# Altium project pca10156.PrjPCB (part 3 of 4)

## Sheet pca10156_sheet6_power_supply.SchDoc: =BoardTitle+' - Power Supply'
size A3; Organization: Nordic Semiconductor; DocumentNumber: 6; Revision: 1.0.0; SheetNumber: 6; SheetTotal: 8; Author: STL1; CompanyName: Nordic Semiconductor; DrawnBy: STL1; DocumentSize: A4
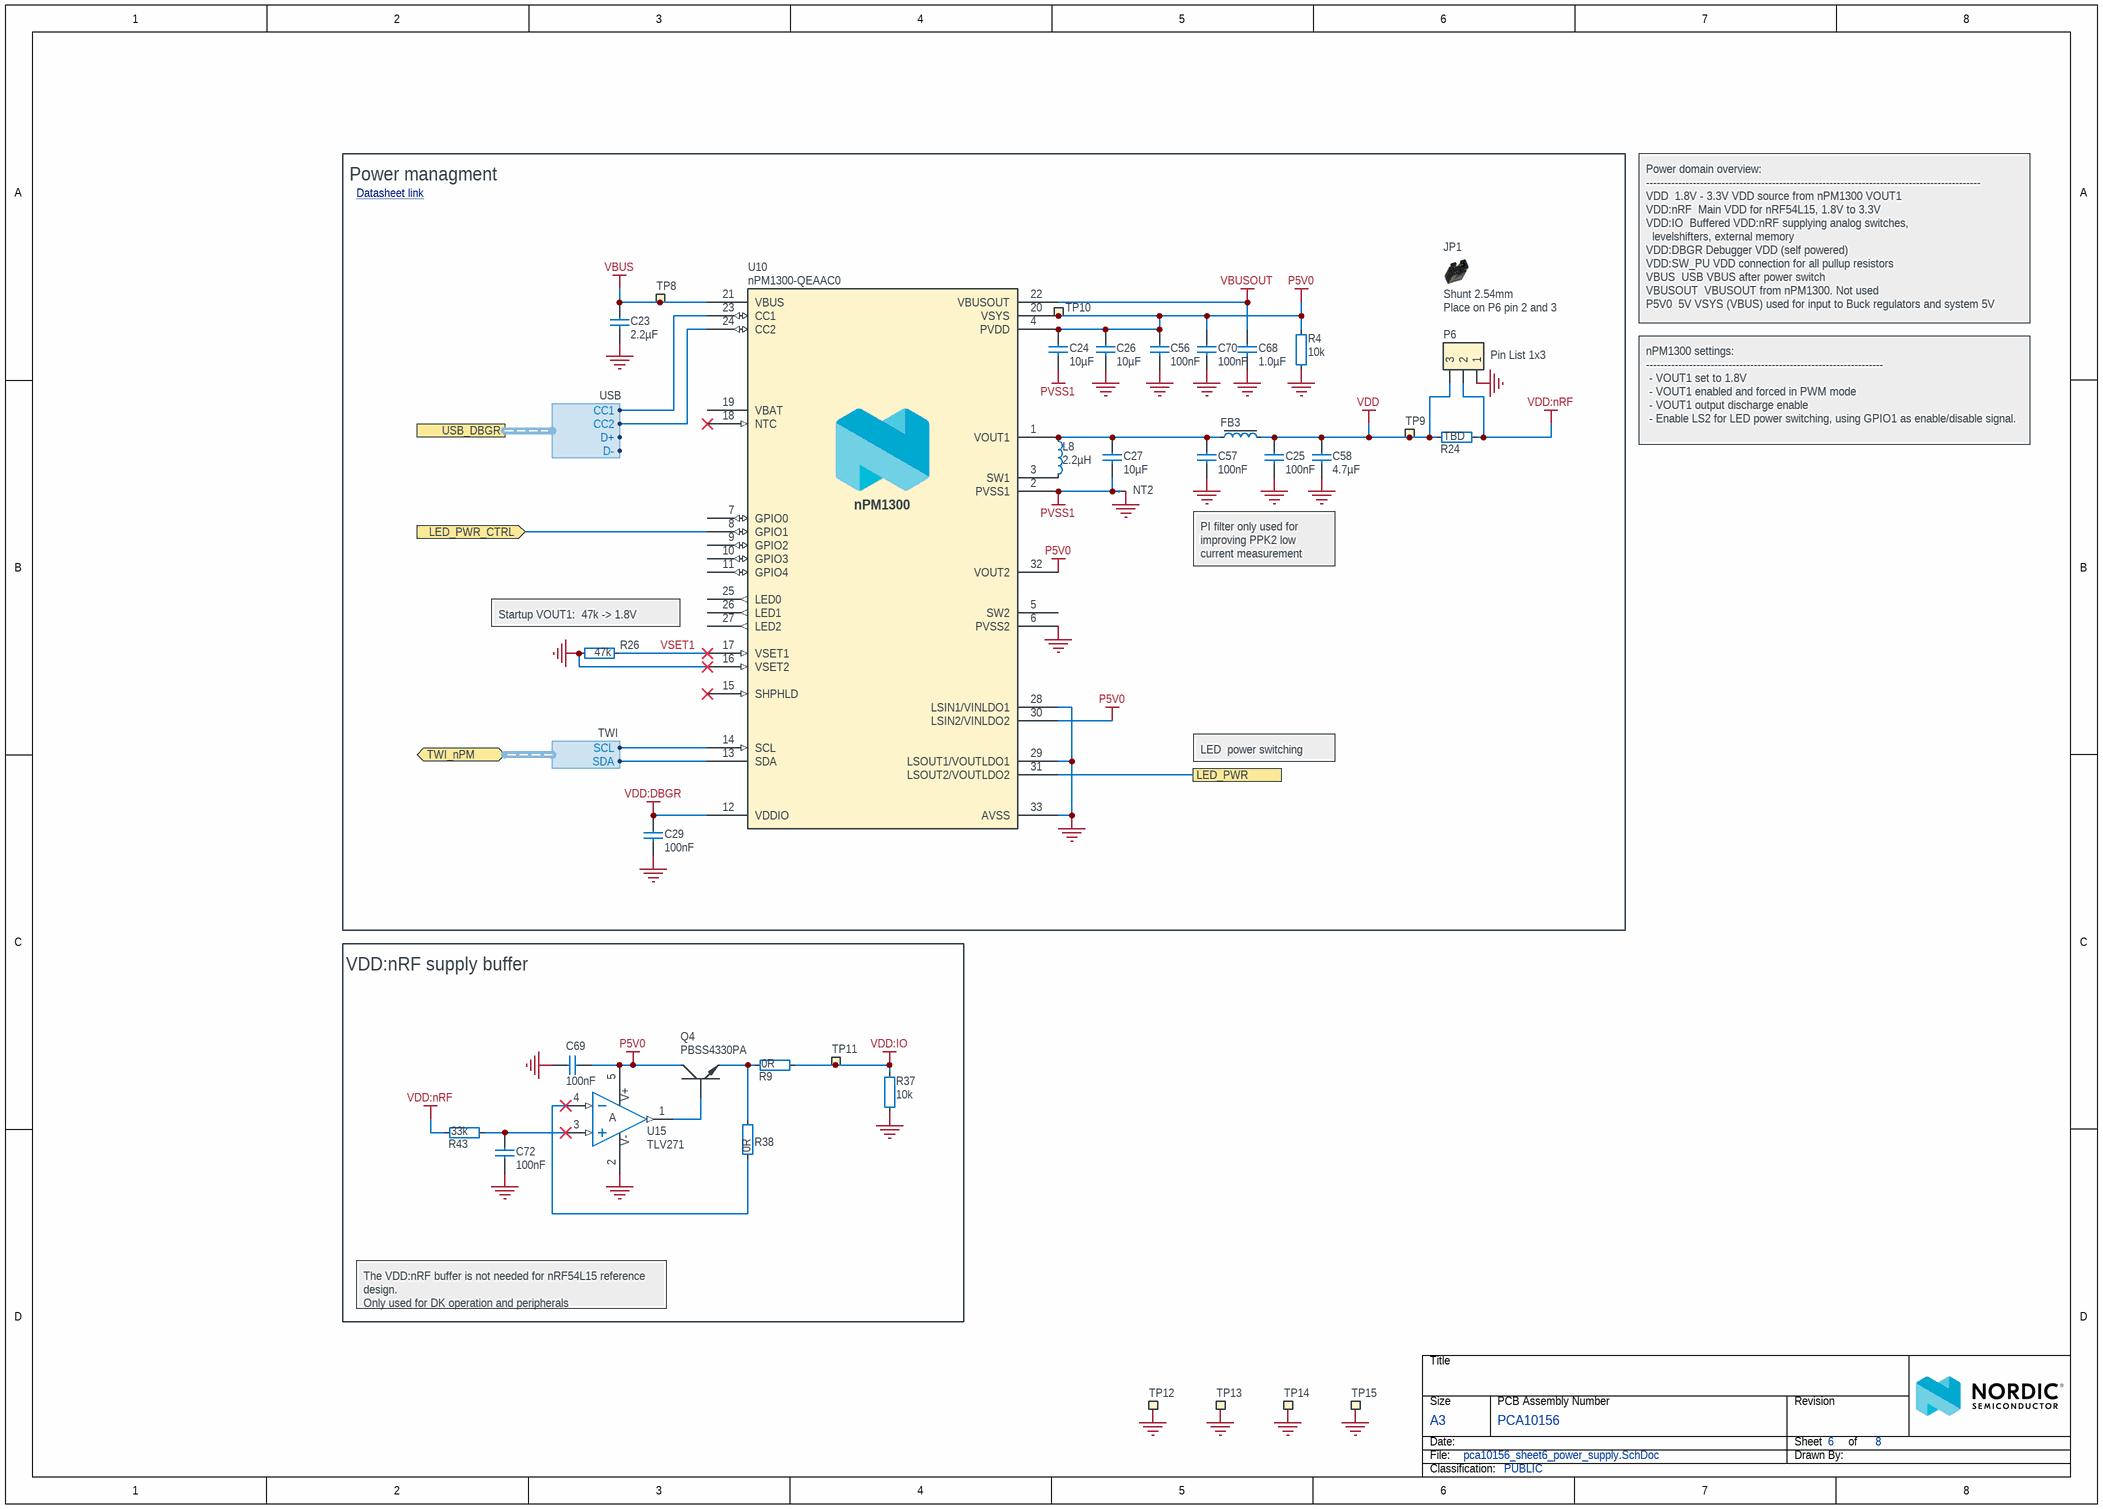
[diagram p5: pca10156_sheet6_power_supply.SchDoc]

### Parts
C23  2.2µF  [CAPC1005X04L]
C24  10µF  [CAPC1608X06L]
C25  100nF  [CAPC0603X03L_C]
C26  10µF  [CAPC1608X06L]
C27  10µF  [CAPC1608X06L]
C29  100nF  [CAPC0603X03L_C]
C56  100nF  [CAPC0603X03L_C]
C57  100nF  [CAPC0603X03L_C]
C58  4.7µF  [CAPC1608X06L]
C68  1.0µF  [CAPC1005X04L]
C69  100nF  [CAPC0603X03L_C]
C70  100nF  [CAPC0603X03L_C]
C72  100nF  [CAPC0603X03L_C]
FB3  120R/0.55A  [INDC1005X04L]  (value not drawn)
JP1  Shunt 2.54mm  Assembly: Place on P6 pin 2 and 3  [Shunt_2.54mm_Vertical]
L8  2.2µH  [INDC2016X10N]
NT2  Net tie  [2 PIN STARPOINT]  (value not drawn)  (net tie, no BOM)
P6  Pin List 1x3  [LIST_1x3_SMD]
Q4  PBSS4330PA  [DFN105P200X65-3N_v2]
R4  10k  [RESC0603X03L_C]
R9  0R  [RESC0603X03L_C]
R24  TBD  [RESC1005X04L]
R26  47k  [RESC0603X03L_C]
R37  10k  [RESC0603X03L_C]
R38  0R  [RESC0603X03L_C]
R43  33k  [RESC0603X03L_C]
TP8  Ø1.5mm,SMD  [TP_SMD_D1.5mm]  (value not drawn)  (no BOM)
TP9  Ø1.5mm,SMD  [TP_SMD_D1.5mm]  (value not drawn)  (no BOM)
TP10  Ø1.5mm,SMD  [TP_SMD_D1.5mm]  (value not drawn)  (no BOM)
TP11  Ø1.5mm,SMD  [TP_SMD_D1.5mm]  (value not drawn)  (no BOM)
TP12  Ø1.5mm,SMD  [TP_SMD_D1.5mm]  (value not drawn)  (no BOM)
TP13  Ø1.5mm,SMD  [TP_SMD_D1.5mm]  (value not drawn)  (no BOM)
TP14  Ø1.5mm,SMD  [TP_SMD_D1.5mm]  (value not drawn)  (no BOM)
TP15  Ø1.5mm,SMD  [TP_SMD_D1.5mm]  (value not drawn)  (no BOM)
U10  nPM1300-QEAAC0  [Nordic_QFN50P500X500X90-33N]
U15  TLV271  [SOT95P280X145-5N]

### Blocks framed on the sheet
Power managment: C23-C27 C29 C56-C58 C68 C70 FB3 JP1 L8 NT2 P6 R4 R24 R26 TP8-TP10 U10
VDD:nRF supply buffer: C69 C72 Q4 R9 R37 R38 R43 TP11 U15

### Ports
LED_PWR, LED_PWR_CTRL (in), TWI_nPM (bidir, harness TWI), USB_DBGR (harness USB)

### Harnesses
TWI: SDA, SCL
USB: D+, D-, CC1, CC2

### Nets
GND: C23.1 C25.1 C26.1 C29.2 C56.1 C57.1 C58.2 C68.1 C69.2 C70.1 C72.2 NT2.1 P6.1 R4.1 R26.2 R37.1 TP12.1 TP13.1 TP14.1 TP15.1 U10.6(PVSS2) U10.16(VSET2) U10.28(LSIN1/VINLDO1) U10.29(LSOUT1/VOUTLDO1) U10.33(AVSS) U15.2(VSS)
P5V0: C24.2 C26.2 C56.2 C69.1 C70.2 Q4.3(C) R4.2 TP10.1 U10.4(PVDD) U10.20(VSYS) U10.30(LSIN2/VINLDO2) U10.32(VOUT2) U15.5(VDD)
PVSS1: C24.1 C27.1 NT2.2 U10.2(PVSS1)
VBUS: C23.2 TP8.1 U10.21(VBUS)
VBUSOUT: C68.2 U10.22(VBUSOUT)
VDD: C25.2 C58.1 FB3.2 P6.3 R24.2 TP9.1
VDD:DBGR: C29.1 U10.12(VDDIO)
VDD:IO: R9.2 R37.2 TP11.1
VDD:nRF: P6.2 R24.1 R43.1
LED_PWR_CTRL: U10.8(GPIO1) ; port LED_PWR_CTRL
TWI0_SCL: U10.14(SCL) ; port TWI_nPM.SCL
TWI0_SDA: U10.13(SDA) ; port TWI_nPM.SDA
VSET1: R26.1 U10.17(VSET1)
NetC27_2: C27.2 C57.2 FB3.1 L8.1 U10.1(VOUT1)
NetC64_2: U10.31(LSOUT2/VOUTLDO2) ; port LED_PWR
NetC72_1: C72.1 R43.2 U15.3(IN+)
NetJ3_A5: U10.23(CC1) ; port USB_DBGR.CC1
NetJ3_B5: U10.24(CC2) ; port USB_DBGR.CC2
NetL8_2: L8.2 U10.3(SW1)
NetQ4_1: Q4.1(B) U15.1(OUT)
NetQ4_2: Q4.2(E) R9.1 R38.2
NetR38_1: R38.1 U15.4(IN-)

Not connected (* = marked no-connect by the designer): U10 5(SW2) 7(GPIO0) 9(GPIO2) 10(GPIO3) 11(GPIO4) 15(SHPHLD)* 18(NTC)* 19(VBAT) 25(LED0) 26(LED1) 27(LED2)

### Notes on the sheet
- Datasheet link <https://www.nordicsemi.com/Products/nPM1300>
- Power domain overview:
  ---------------------------------------------------------------------------------------------
  VDD		1.8V - 3.3V VDD source from nPM1300 VOUT1
  VDD:nRF		Main VDD for nRF54L15, 1.8V to 3.3V
  VDD:IO		Buffered VDD:nRF supplying analog switches,
  levelshifters, external memory
  VDD:DBGR	Debugger VDD (self powered)
  VDD:SW_PU	VDD connection for all pullup resistors
  VBUS		USB VBUS after power switch
  VBUSOUT		VBUSOUT from nPM1300. Not used
  P5V0		5V VSYS (VBUS) used for input to Buck regulators and system 5V
- nPM1300 settings:
  ------------------------------------------------------------------
  - VOUT1 set to 1.8V
  - VOUT1 enabled and forced in PWM mode
  - VOUT1 output discharge enable
  - Enable LS2 for LED power switching, using GPIO1 as enable/disable signal.
- PI filter only used for improving PPK2 low current measurement accuracy
- (near R26) Startup VOUT1:  47k -> 1.8V
- LED  power switching
- The VDD:nRF buffer is not needed for nRF54L15 reference design.
  Only used for DK operation and peripherals
- Title
- Size
- Date:
- File:
- A3
- PCB Assembly Number
- Sheet
- Drawn By:
- Revision
- of
- Classification:
- (in symbol nPM1300-QEAAC0) nPM1300
- (in symbol TLV271CW5-7) V+; A; V-

### Library data of the parts
C23 = C0402-2µ2-10V: Capacitor, X5R, ±10%; Manufacturer: N.A.; Part number NEMS: 100200376; Component Status: Active; Pad Count: 2; Note: 10V; Part Number: C0402-2µ2-10V; PartId: 100200376; Component Class: Capacitors; Author: rsk; Manufacturer Part Number: N.A.; ComponentLink1URL: N.A.; ComponentLink1Description: Datasheet; ComponentLink2URL: N.A.; ComponentLink2Description: Supplier link; HelpURL: N.A.; LatestRevisionDate: 2020-10-13; Published: 2016-08-22; Footprint Doc: 0402; Value: 2.2µF; Supplier 1: Digi-Key; Supplier Part Number 1: 490-10451-1-ND; Supplier 2: N.A.; Supplier Part Number 2: N.A.; Artikkelnr Noca: N.A.; Part number IPS: N.A.; Part number Norautron: N.A.
C24 C26 C27 = C0603-10µ-10V-X7T-GRM188D71A106MA73: Capacitor, X7T, ±20%, 10V; Manufacturer: Murata; Part number IPS: 00000004696; Part number NEMS: 100200414; Component Status: Active; Pad Count: 2; Note: 10VDC; Artikkelnr Noca: N.A.; Part Number: C0603-10µ-10V-X7T-GRM188D71A106MA73; PartId: 100200414; Component Class: Capacitors; Author: rsk; Manufacturer Part Number: GRM188D71A106MA73; ComponentLink1URL: N.A.; ComponentLink1Description: Datasheet; ComponentLink2URL: N.A.; ComponentLink2Description: Supplier link; HelpURL: https://no.mouser.com/datasheet/2/281/murata_03052018_GRM_Series_1-1310166.pdf; LatestRevisionDate: 2021-07-22; Published: 2018-09-11; Footprint Doc: 0603; Value: 10µF; Supplier 1: Digi-Key; Supplier Part Number 1: 490-7200-1-ND; Supplier 2: Mouser; Supplier Part Number 2: 81-GRM188D71A106MA3D; Part number Norautron: N.A.
C25 C56 C57 C70 = C0201-100n: as C64 on sheet pca10156_sheet5_misc; Part Number: C0201-100n; Manufacturer Part Number: N.A.; LatestRevisionDate: 2017-11-09; Published: 2014-11-13; Value: 100nF; Artikkelnr Noca: N.A.; Footprint Doc: 0201; ComponentLink1URL: N.A.; ComponentLink1Description: Datasheet; ComponentLink2URL: N.A.; ComponentLink2Description: Supplier link; HelpURL: N.A.; Supplier 1: N.A.; Supplier Part Number 1: N.A.; Supplier 2: N.A.; Supplier Part Number 2: N.A.; Component Class: Capacitors; PartId: 100200078; Author: rsk
C29 C69 C72 = C0201-100n: as C4 on sheet pca10156_sheet2_nRF54L15; Part Number: C0201-100n; Value: 100nF; Footprint Doc: 0201; Component Class: Capacitors; Author: rsk; PartId: 100200078; Manufacturer Part Number: N.A.; ComponentLink1URL: N.A.; ComponentLink1Description: Datasheet; ComponentLink2URL: N.A.; ComponentLink2Description: Supplier link; HelpURL: N.A.; LatestRevisionDate: 2017-11-09; Published: 2014-11-13; Supplier 1: N.A.; Supplier Part Number 1: N.A.; Supplier 2: N.A.; Supplier Part Number 2: N.A.; Artikkelnr Noca: N.A.
C58 = C0603-4µ7-10V-X7S: as C42 on sheet pca10156_sheet3_debugger; Part Number: C0603-4µ7-10V-X7S; Value: 4.7µF; Footprint Doc: 0603; Component Class: Capacitors; Author: rsk; PartId: 100200351; Manufacturer Part Number: N.A.; ComponentLink1URL: N.A.; ComponentLink1Description: Datasheet; ComponentLink2URL: N.A.; ComponentLink2Description: Supplier link; HelpURL: N.A.; LatestRevisionDate: 2016-08-15; Published: 2016-08-15; Note: 10V; Supplier 1: Digi-Key; Supplier Part Number 1: 445-14258-1-ND; Supplier 2: N.A.; Supplier Part Number 2: N.A.; Part number Norautron: N.A.
C68 = C0402-1µ0-6.3V-X5R-10%: as C31 on sheet pca10156_sheet3_debugger; Part Number: C0402-1µ0-6.3V-X5R-10%; Manufacturer Part Number: N.A.; LatestRevisionDate: 2022-01-27; Published: 2022-01-27; Value: 1.0µF; Note: 6.3V; Artikkelnr Noca: N.A.; Footprint Doc: 0402; ComponentLink1URL: N.A.; ComponentLink1Description: Datasheet; ComponentLink2URL: N.A.; ComponentLink2Description: Supplier link; HelpURL: N.A.; Supplier 1: N.A.; Supplier Part Number 1: N.A.; Supplier 2: N.A.; Supplier Part Number 2: N.A.; Part number IPS: N.A.; Component Class: Capacitors; PartId: 100200498; Author: rubr
FB3 = FB0402-120R@100M-500mA: Ferrite Bead, 120 Ohm @ 100MHz, 500mA, 250 mOhm Max; Manufacturer: Murata; Manufacturer Part Number: BLM15AG121SN1D; Part number IPS: 00000009954; Part number Norautron: 265230631; Part number NEMS: 100300099; Note: Chip EMIFIL Inductor Type Chip Ferrite Bead; Artikkelnr Noca: 33029317; Pad Count: 2; Component Status: Active; Part Number: FB0402-120R@100M-500mA; Footprint Doc: 0402; LatestRevisionDate: 2014-01-10; Published: 2011-11-14; Value: 120R/0.55A; ComponentLink1Description: Datasheet; ComponentLink2Description: Supplier link; ComponentLink1URL: N.A.; ComponentLink2URL: N.A.; HelpURL: http://search.murata.co.jp/Ceramy/image/img/PDF/ENG/L0110S0100BLM15A_SN.pdf; Supplier 1: Digi-Key; Supplier Part Number 1: 490-1005-1-ND; Supplier 2: Farnell; Supplier Part Number 2: 151-5760; Component Class: Inductors; PartId: 100300099; Author: rsk
JP1 = SHUNT JUMPER 2.54mm Black Vertical: Shunt Jumper 2.54mm Black, open top; Manufacturer: WCON; Manufacturer Part Number: 3710-6001OS0B05; Part number NEMS: 100500728; Pad Count: 2; Note: N.A.; Component Status: Active; System: Connector; Part Number: SHUNT JUMPER 2.54mm Black Vertical; PartId: 100500752; Component Class: Connectors; Author: masi; ComponentLink1URL: N.A.; ComponentLink1Description: Datasheet; ComponentLink2URL: N.A.; ComponentLink2Description: Supplier link; HelpURL: N.A.; Footprint Doc: SHUNT JUMPER 2.54mm; LatestRevisionDate: 2024-08-02; Published: 2022-07-01; Value: Shunt 2.54mm; Supplier 1: Cabcon; Supplier Part Number 1: 3710-6001OS0B05; Supplier 2: N.A.; Supplier Part Number 2: N.A.; Artikkelnr Noca: N.A.; Part number IPS: N.A.; Part number Norautron: N.A.
L8 = L0806-2µ2-2500mA-73mOhm-CIGT201610EH2R2MNE: Inductor, Irms=2.5A, Isat=2.9A, ±20%, DCR=73mΩ; Manufacturer: Samsung Electro-Mechanics America; Part number Norautron: 26521789; Part number NEMS: 100300400; Component Status: Active; Pad Count: 2; Note: Unshielded Thin Film Inductor; Artikkelnr Noca: N.A.; Part Number: L0806-2µ2-2500mA-73mOhm-CIGT201610EH2R2MNE; PartId: 100300400; Component Class: Inductors; Author: rsk; Manufacturer Part Number: CIGT201610EH2R2MNE; ComponentLink1URL: https://media.digikey.com/pdf/Data%20Sheets/Samsung%20PDFs/CIGT201610EH2R2MNE_Spec.pdf; ComponentLink1Description: Datasheet; ComponentLink2URL: https://www.digikey.com/en/products/detail/samsung-electro-mechanics/CIGT201610EH2R2MNE/7041223?s=N4IgTCBcDaIMIEkDiAVMAGAjANk%2BgogBJgBKYAsgHL4gC6AvkA; ComponentLink2Description: Supplier link; HelpURL: http://product.samsungsem.com/pi/CIGT201610EH2R2MN.do; LatestRevisionDate: 2022-09-07; Published: 2021-02-03; Footprint Doc: 0806; Value: 2.2µH; Supplier 1: Digi-Key; Supplier Part Number 1: 1276-6901-1-ND; Supplier 2: Mouser; Supplier Part Number 2: 187-CIGT201610EH2R2M; Part number IPS: N.A.
NT2 = 2 pin starpoint: Starpoint; Manufacturer: N.A.; Part number NEMS: 100500603; Pad Count: 2; Component Status: Active; System: Connector; Part Number: 2 pin starpoint; Manufacturer Part Number: N.A.; ComponentLink1URL: N.A.; ComponentLink1Description: Datasheet; ComponentLink2URL: N.A.; ComponentLink2Description: Supplier link; HelpURL: N.A.; Footprint Doc: N.A.; LatestRevisionDate: 2017-08-31; Published: 2017-08-31; Value: Net tie; Note: Net tie; Supplier 1: N.A.; Supplier Part Number 1: N.A.; Supplier 2: N.A.; Supplier Part Number 2: N.A.; Artikkelnr Noca: N.A.; Part number IPS: N.A.; Component Class: Connectors; PartId: 100500603; Author: rsk; Part number Norautron: N.A.
P6 = Pin List 1x3 SMD: Pin List 1x3, 2.54mm (100mil), SMD; Manufacturer: WCON; Manufacturer Part Number: 1125-1103S0M116CR04; Part number Norautron: 26470016; Part number NEMS: 100500306; Note: N.A.; Pad Count: 3; Component Status: Active; System: Connector; Part Number: Pin List 1x3 SMD; Footprint Doc: LIST_1x3_SMD; LatestRevisionDate: 2021-09-24; Published: 2013-10-21; Value: Pin List 1x3; Artikkelnr Noca: N.A.; ComponentLink1URL: N.A.; ComponentLink1Description: Datasheet; ComponentLink2URL: N.A.; ComponentLink2Description: Supplier link; HelpURL: N.A.; Part number IPS: N.A.; Supplier 1: Cabcon; Supplier Part Number 1: 1125-1103S0M116CR04; Supplier 2: Samtec; Supplier Part Number 2: TSM-103-01-L-SV-P-TR; Component Class: Connectors; PartId: 100500306; Author: rsk
Q4 = PBSS4330PA,115: 30V, 3A, 2.1W, G=270, NPN Transistor; Manufacturer: Nexperia; Part number NEMS: 101300184; Component Status: Active; Pad Count: 3; Note: N.A.; Part Number: PBSS4330PA,115; PartId: 101300184; Component Class: Semiconductors; Author: rubr; Manufacturer Part Number: PBSS4330PA,115; ComponentLink1URL: https://assets.nexperia.com/documents/data-sheet/PBSS4330PA.pdf; ComponentLink1Description: Datasheet; ComponentLink2URL: https://www.digikey.com/en/products/detail/nexperia-usa-inc/PBSS4330PA-115/2296330; ComponentLink2Description: Supplier link; HelpURL: https://www.nexperia.com/products/bipolar-transistors/general-purpose-and-low-vcesat-bipolar-transistors/single-bipolar-transistors/single-bipolar-transistors-100-v/PBSS4330PA.html; LatestRevisionDate: 2021-06-03; Published: 2021-06-03; Footprint Doc: HUSON-3 (2x2); Value: PBSS4330PA; Supplier 1: Digi-Key; Supplier Part Number 1: 1727-5112-1-ND‎; Supplier 2: N.A.; Supplier Part Number 2: N.A.; Artikkelnr Noca: N.A.; Part number IPS: N.A.; Part number Norautron: N.A.
R4 R37 = R0201-10k: Resistor, ±1%, 0.05W; Manufacturer: N.A.; Part number IPS: 00000001255; Part number Norautron: 26107101; Part number NEMS: 100100065; Component Status: Active; Pad Count: 2; Note: Chip Res 1%; Part Number: R0201-10k; PartId: 100100065; Component Class: Resistors; Author: rsk; Manufacturer Part Number: N.A.; ComponentLink1URL: N.A.; ComponentLink1Description: Datasheet; ComponentLink2URL: N.A.; ComponentLink2Description: Supplier link; HelpURL: N.A.; LatestRevisionDate: 2014-11-13; Published: 2014-11-13; Footprint Doc: 0201; Value: 10k; Supplier 1: N.A.; Supplier Part Number 1: N.A.; Supplier 2: N.A.; Supplier Part Number 2: N.A.; Artikkelnr Noca: N.A.
R9 R38 = R0201-0R: Resistor, ±5%, 0.05W; Manufacturer: N.A.; Part number IPS: 00000003245; Part number NEMS: 100100001; Component Status: Active; Pad Count: 2; Note: Chip Res 5%; Part Number: R0201-0R; PartId: 100100001; Component Class: Resistors; Author: rsk; Manufacturer Part Number: N.A.; ComponentLink1URL: N.A.; ComponentLink1Description: Datasheet; ComponentLink2URL: N.A.; ComponentLink2Description: Supplier link; HelpURL: N.A.; LatestRevisionDate: 2017-11-09; Published: 2014-11-13; Footprint Doc: 0201; Value: 0R; Supplier 1: N.A.; Supplier Part Number 1: N.A.; Supplier 2: N.A.; Supplier Part Number 2: N.A.; Artikkelnr Noca: N.A.; Part number Norautron: N.A.
R24 = R0402-TBD: Chip Res 0402; Manufacturer: N.A.; Part number NEMS: 100100282; Component Status: Active; Pad Count: 2; Part Number: R0402-TBD; PartId: 100100282; Component Class: Resistors; Author: rsk; Manufacturer Part Number: N.A.; ComponentLink1URL: N.A.; ComponentLink1Description: Datasheet; ComponentLink2URL: N.A.; ComponentLink2Description: Supplier link; HelpURL: N.A.; LatestRevisionDate: 2010-12-21; Published: 2010-12-21; Footprint Doc: 0402; Value: TBD; Note: Chip Res; Supplier 1: N.A.; Supplier Part Number 1: N.A.; Supplier 2: N.A.; Supplier Part Number 2: N.A.; Artikkelnr Noca: N.A.; Part number IPS: N.A.; Part number Norautron: N.A.
R26 = R0201-47k: Resistor, ±1%, 0.05W; Manufacturer: N.A.; Part number IPS: 00000001423; Part number NEMS: 100100076; Component Status: Active; Pad Count: 2; Note: Chip Res 1%; Part Number: R0201-47k; PartId: 100100076; Component Class: Resistors; Author: rsk; Manufacturer Part Number: N.A.; ComponentLink1URL: N.A.; ComponentLink1Description: Datasheet; ComponentLink2URL: N.A.; ComponentLink2Description: Supplier link; HelpURL: N.A.; LatestRevisionDate: 2014-11-13; Published: 2014-11-13; Footprint Doc: 0201; Value: 47k; Supplier 1: N.A.; Supplier Part Number 1: N.A.; Supplier 2: N.A.; Supplier Part Number 2: N.A.; Artikkelnr Noca: N.A.; Part number Norautron: N.A.
R43 = R0201-33k: Resistor, ±1%, 0.05W; Manufacturer: N.A.; Part number IPS: 00000001708; Part number NEMS: 100100073; Component Status: Active; Pad Count: 2; Note: Chip Res 1%; Part Number: R0201-33k; PartId: 100100073; Component Class: Resistors; Author: rsk; Manufacturer Part Number: N.A.; ComponentLink1URL: N.A.; ComponentLink1Description: Datasheet; ComponentLink2URL: N.A.; ComponentLink2Description: Supplier link; HelpURL: N.A.; LatestRevisionDate: 2014-11-13; Published: 2014-11-13; Footprint Doc: 0201; Value: 33k; Supplier 1: N.A.; Supplier Part Number 1: N.A.; Supplier 2: N.A.; Supplier Part Number 2: N.A.; Artikkelnr Noca: N.A.; Part number Norautron: N.A.
TP8-TP15 = TP_SMD_Ø1.5MM: as TP1 on sheet pca10156_sheet2_nRF54L15; Part Number: TP_SMD_Ø1.5MM; ComponentLink1URL: N.A.; ComponentLink1Description: Datasheet; ComponentLink2URL: N.A.; ComponentLink2Description: Supplier link; HelpURL: N.A.; Footprint Doc: TP_SMD_Ø1.5mm; LatestRevisionDate: 2021-03-05; Published: 2016-06-02; Value: Ø1.5mm,SMD; Note: N.A.; Supplier 1: N.A.; Supplier Part Number 1: N.A.; Supplier 2: N.A.; Supplier Part Number 2: N.A.; Artikkelnr Noca: N.A.; Part number IPS: N.A.; Component Class: Connectors; PartId: 100500477; Author: rsk; Part number Norautron: N.A.
U10 = nPM1300-QEAAC0: Li-Ion/Li-Polymer USB-C battery charger with high efficiency buck regulators, LDOs or load switches, LED drivers, TWI and VBUSOUT; Manufacturer: Nordic Semiconductor; Part number NEMS: 102000306; Component Status: Active; Pad Count: 33; Note: Production version; Artikkelnr Noca: N.A.; Part Number: nPM1300-QEAAC0; PartId: 102000306; Component Class: Nordic_Devices; Author: eisk; Manufacturer Part Number: nPM1300-QEAAC0; ComponentLink1URL: N.A.; ComponentLink1Description: Datasheet; ComponentLink2URL: N.A.; ComponentLink2Description: Supplier link; HelpURL: N.A.; LatestRevisionDate: 2023-08-16; Published: 2023-08-16; Footprint Doc: QFN-32; Value: nPM1300-QEAAC0; Supplier 1: Nordic Semiconductor; Supplier Part Number 1: nPM1300-QEAAC0; Supplier 2: N.A.; Supplier Part Number 2: N.A.; Part number IPS: N.A.; Part number Norautron: N.A.
U15 = TLV271CW5-7: Dual rail to rail CMOS Amplifier; Manufacturer: Diodes Incorporated; Part number NEMS: 101900398; Component Status: Active; Pad Count: 5; Note: N.A.; Part Number: TLV271CW5-7; PartId: 101900398; Component Class: Misc_ICs; Author: rsk; Manufacturer Part Number: TLV271CW5-7; ComponentLink1URL: N.A.; ComponentLink1Description: Datasheet; ComponentLink2URL: N.A.; ComponentLink2Description: Supplier link; HelpURL: http://www.diodes.com/_files/datasheets/TLV27x.pdf; LatestRevisionDate: 2016-04-05; Published: 2016-04-05; Footprint Doc: SOT-25; Value: TLV271; Supplier 1: Digi-Key; Supplier Part Number 1: TLV271CW5-7DICT-ND; Supplier 2: N.A.; Supplier Part Number 2: N.A.; Artikkelnr Noca: N.A.; Part number IPS: N.A.; Part number Norautron: N.A.

## Sheet pca10156_sheet7_connectors.SchDoc: =BoardTitle+' - Connectors'
size A3; Organization: Nordic Semiconductor; DocumentNumber: 7; Revision: 1.0.0; SheetNumber: 7; SheetTotal: 8; Author: STL1; CompanyName: Nordic Semiconductor; DrawnBy: STL1; DocumentSize: A4
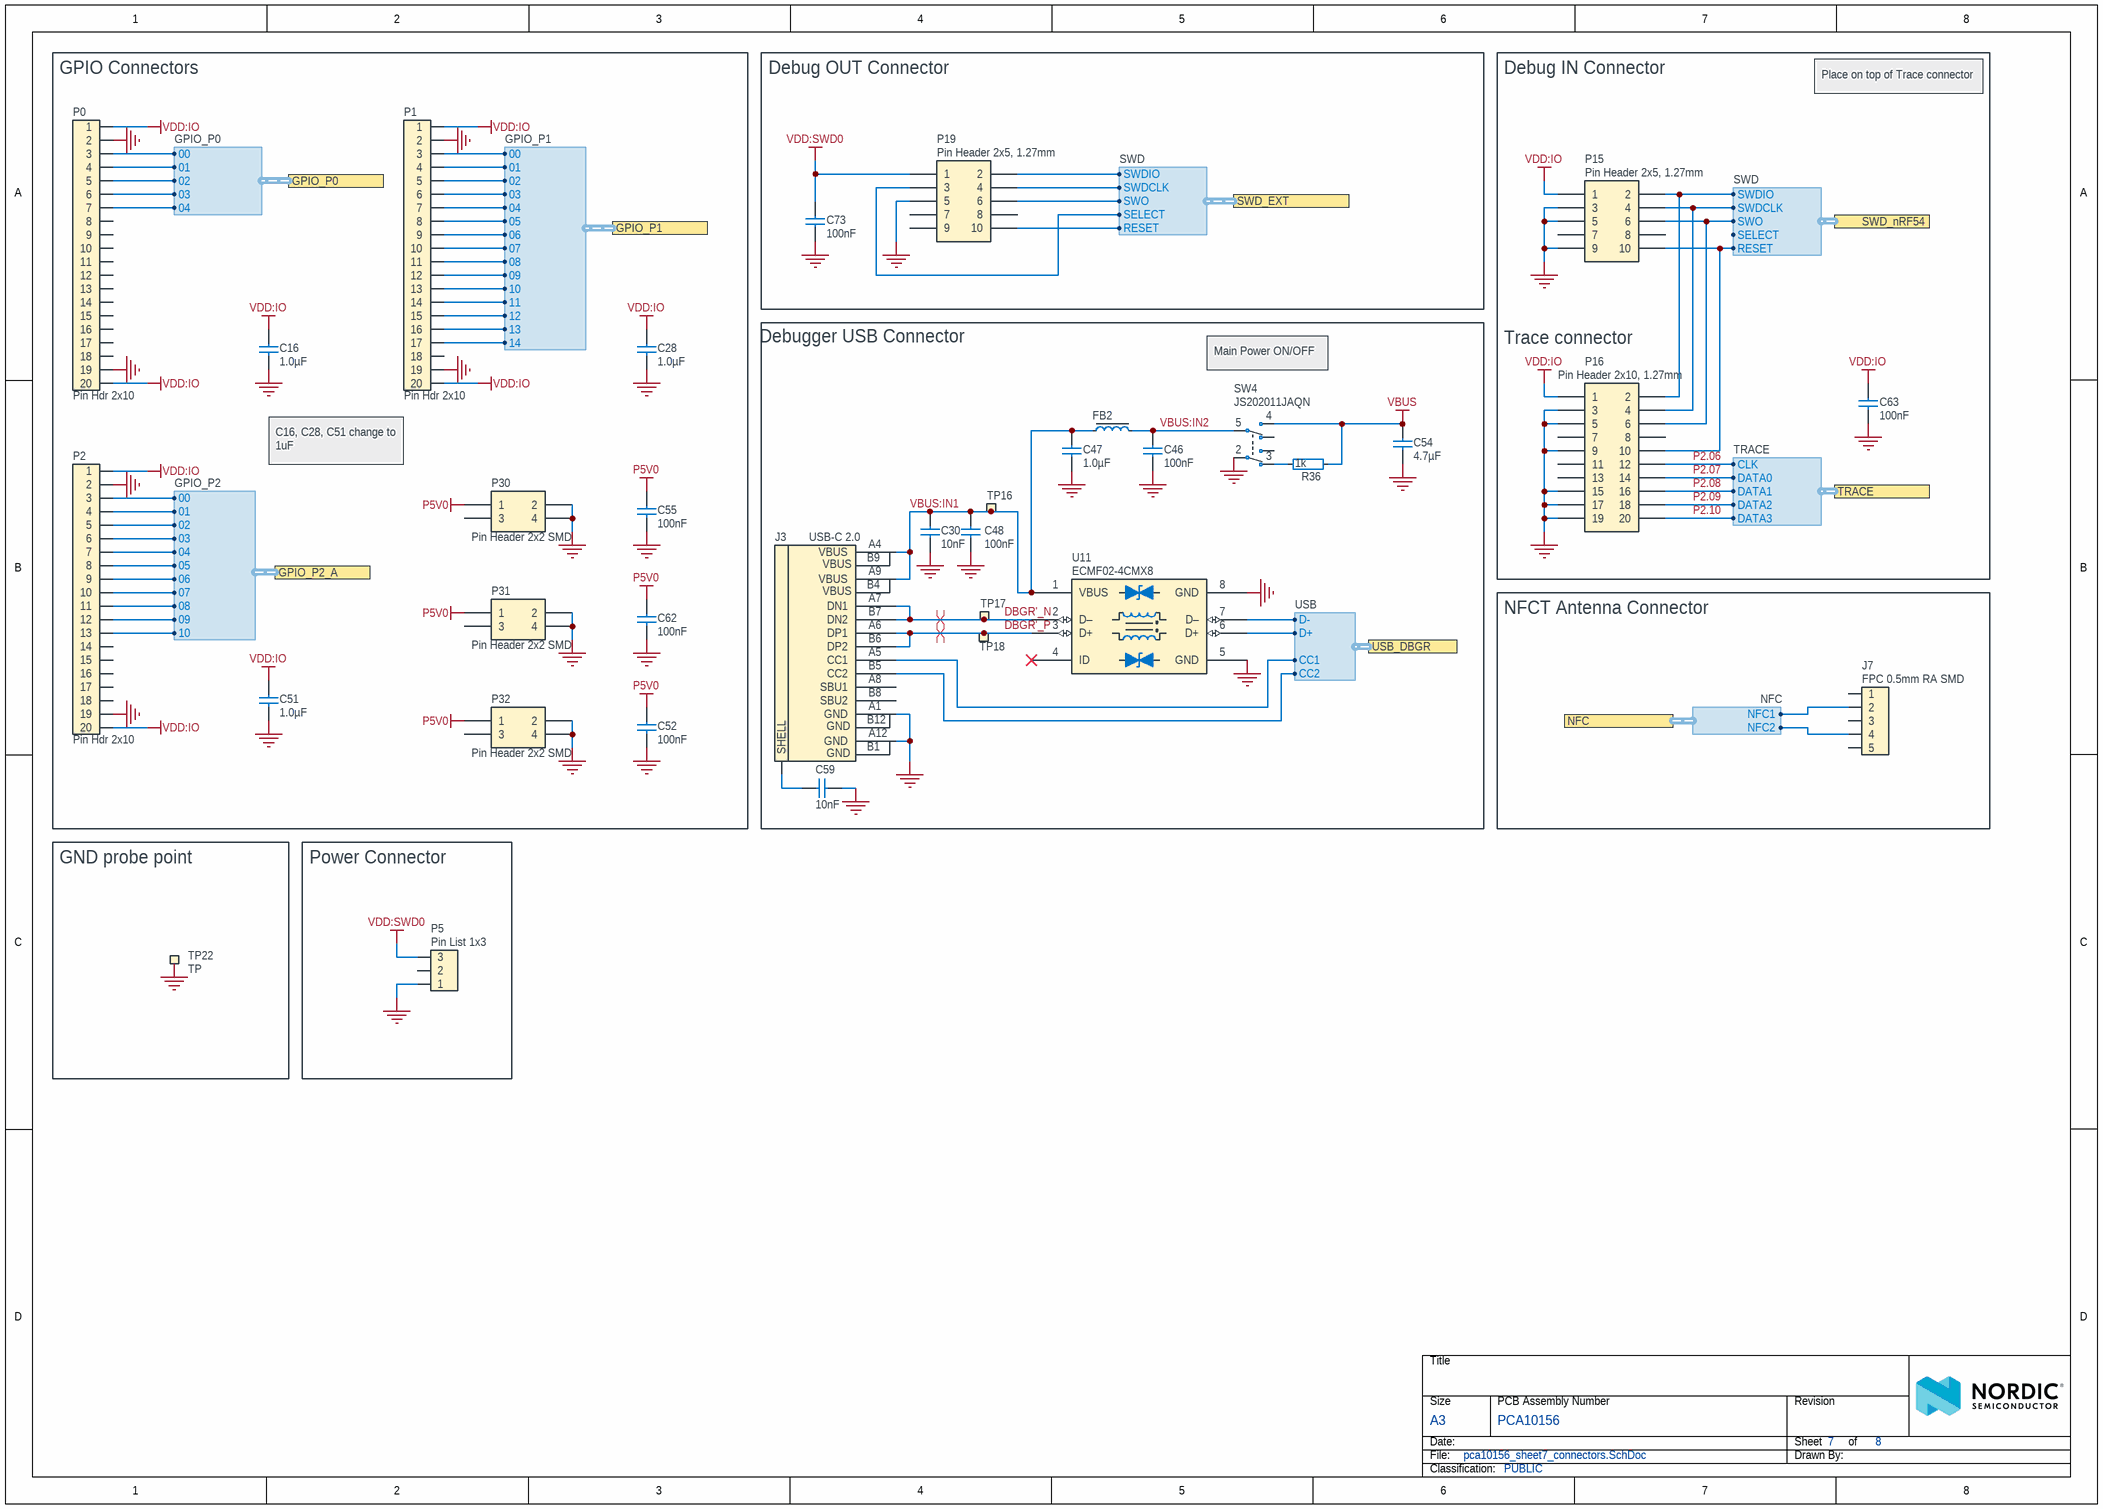
[diagram p6: pca10156_sheet7_connectors.SchDoc]

### Parts
C16  1.0µF  [CAPC1005X04L]
C28  1.0µF  [CAPC1005X04L]
C30  10nF  [CAPC0603X03L_C]
C46  100nF  [CAPC0603X03L_C]
C47  1.0µF  [CAPC1005X04L]
C48  100nF  [CAPC0603X03L_C]
C51  1.0µF  [CAPC1005X04L]
C52  100nF  [CAPC0603X03L_C]
C54  4.7µF  [CAPC1608X06L]
C55  100nF  [CAPC0603X03L_C]
C59  10nF  [CAPC1608X06L]
C62  100nF  [CAPC0603X03L_C]
C63  100nF  [CAPC0603X03L_C]
C73  100nF  [CAPC0603X03L_C]
FB2  120R/0.55A  [INDC1005X04L]  (value not drawn)
J3  USB-C 2.0  [SD-80259-001]
J7  FPC 0.5mm RA SMD  [FPC_05P-0.5mm-RA-SMD]
P0  Pin Hdr 2x10  [HDR_2x10-SMD]
P1  Pin Hdr 2x10  [HDR_2x10-SMD]
P2  Pin Hdr 2x10  [HDR_2x10-SMD]
P5  Pin List 1x3  [LIST_1x3_SMD]
P15  Pin Header 2x5, 1.27mm  [HDR_2x5-SMD-1.27mm-K]
P16  Pin Header 2x10, 1.27mm  [HDR_2x10-SMD-1.27mm-NC]
P19  Pin Header 2x5, 1.27mm  [HDR_2x5-SMD-1.27mm-K]
P30  Pin Header 2x2 SMD  [HDR_2x2-SMD]
P31  Pin Header 2x2 SMD  [HDR_2x2-SMD]
P32  Pin Header 2x2 SMD  [HDR_2x2-SMD]
R36  1k  [RESC0603X03L_C]
SW4  Manufacturer Part Number: JS202011JAQN  [JS102011JAQN]  (hidden comment: Switch)
TP16  Ø1.5mm,SMD  [TP_SMD_D1.5mm]  (value not drawn)  (no BOM)
TP17  Ø1.5mm,SMD  [TP_SMD_D1.5mm]  (value not drawn)  (no BOM)
TP18  Ø1.5mm,SMD  [TP_SMD_D1.5mm]  (value not drawn)  (no BOM)
TP22  TP  [S1751]
U11  ECMF02-4CMX8  [UFDFN50P120X250X55-8N]

### Blocks framed on the sheet
GPIO Connectors: C16 C28 C51 C52 C55 C62 P0-P2 P30-P32
Debug OUT Connector: C73 P19
Debugger USB Connector: C30 C46-C48 C54 C59 FB2 J3 R36 SW4 TP16-TP18 U11
NFCT Antenna Connector: J7
GND probe point: TP22
Power Connector: P5

### Ports
GPIO_P0 (harness GPIO_P0), GPIO_P1 (harness GPIO_P1), GPIO_P2_A (harness GPIO_P2), NFC (harness NFC), SWD_EXT (harness SWD), SWD_nRF54 (harness SWD), TRACE (harness TRACE), USB_DBGR (harness USB)

### Harnesses
USB: D+, D-, CC1, CC2
SWD: SWDIO, SWDCLK, SWO, RESET, SELECT
NFC: NFC2, NFC1
GPIO_P1: 00, 01, 02, 03, 04, 05, 06, 07, 08, 09, 10, 11, 12, 13, 14
GPIO_P2: 00, 01, 02, 03, 04, 05, 06, 07, 08, 09, 10
TRACE: CLK, DATA0, DATA1, DATA3, DATA2
GPIO_P0: 02, 03, 04, 00, 01

### Nets
GND: C16.1 C28.1 C30.2 C46.1 C47.1 C48.1 C51.1 C52.1 C54.2 C55.1 C59.2 C62.1 C63.1 C73.1 J3.A1(GND) J3.A12(GND) P0.2 P0.19 P1.2 P1.19 P2.2 P2.19 P5.1 P15.3 P15.5 P15.9 P16.3 P16.5 P16.9 P16.15 P16.17 P16.19 P19.5 P30.2 P30.4 P31.2 P31.4 P32.2 P32.4 SW4.2(COM-1) TP22.1 U11.5(GND) U11.8(GND)
P5V0: C52.2 C55.2 C62.2 P30.1 P31.1 P32.1
VBUS: C54.1 R36.2 SW4.4(N.O-2)
VDD:IO: C16.2 C28.2 C51.2 C63.2 P0.1 P0.20 P1.1 P1.20 P2.1 P2.20 P15.1 P16.1
VDD:SWD0: C73.2 P5.3 P19.1
DBGR'_N: J3.A7(DN1) J3.B7(DN2) TP17.1 U11.2(D–)
DBGR'_P: J3.A6(DP1) J3.B6(DP2) TP18.1 U11.3(D+)
DBGR_N: U11.7(D–) ; port USB_DBGR.D-
DBGR_P: U11.6(D+) ; port USB_DBGR.D+
NFC1: J7.2 ; port NFC.NFC1
NFC2: J7.4 ; port NFC.NFC2
nRF54_RESET: P15.10 P16.10 ; port SWD_nRF54.RESET
P0.00: P0.3 ; port GPIO_P0.00
P0.01: P0.4 ; port GPIO_P0.01
P0.02: P0.5 ; port GPIO_P0.02
P0.03: P0.6 ; port GPIO_P0.03
P0.04: P0.7 ; port GPIO_P0.04
P1.00: P1.3 ; port GPIO_P1.00
P1.01: P1.4 ; port GPIO_P1.01
P1.04: P1.7 ; port GPIO_P1.04
P1.05: P1.8 ; port GPIO_P1.05
P1.06: P1.9 ; port GPIO_P1.06
P1.07: P1.10 ; port GPIO_P1.07
P1.08: P1.11 ; port GPIO_P1.08
P1.09: P1.12 ; port GPIO_P1.09
P1.10: P1.13 ; port GPIO_P1.10
P1.11: P1.14 ; port GPIO_P1.11
P1.12: P1.15 ; port GPIO_P1.12
P1.13: P1.16 ; port GPIO_P1.13
P1.14: P1.17 ; port GPIO_P1.14
P2.00_A: P2.3 ; port GPIO_P2_A.00
P2.01_A: P2.4 ; port GPIO_P2_A.01
P2.02_A: P2.5 ; port GPIO_P2_A.02
P2.03_A: P2.6 ; port GPIO_P2_A.03
P2.04_A: P2.7 ; port GPIO_P2_A.04
P2.05_A: P2.8 ; port GPIO_P2_A.05
P2.06: P2.9 P16.12 ; port GPIO_P2_A.06, port TRACE.CLK
P2.07: P2.10 P15.6 P16.6 P16.14 ; port SWD_nRF54.SWO, port GPIO_P2_A.07, port TRACE.DATA0
P2.08: P2.11 P16.16 ; port GPIO_P2_A.08, port TRACE.DATA1
P2.09: P2.12 P16.18 ; port GPIO_P2_A.09, port TRACE.DATA2
P2.10: P2.13 P16.20 ; port GPIO_P2_A.10, port TRACE.DATA3
SWD0_CLK_EXT: P19.4 ; port SWD_EXT.SWDCLK
SWD0_IO_EXT: P19.2 ; port SWD_EXT.SWDIO
SWD0_RESET_EXT: P19.10 ; port SWD_EXT.RESET
SWD0_SEL: P19.3 ; port SWD_EXT.SELECT
SWD0_SWO_EXT: P19.6 ; port SWD_EXT.SWO
SWDCLK: P15.4 P16.4 ; port SWD_nRF54.SWDCLK
SWDIO: P15.2 P16.2 ; port SWD_nRF54.SWDIO
VBUS:IN1: C30.1 C47.2 C48.2 FB2.1 J3.A4(VBUS) J3.A9(VBUS) TP16.1 U11.1(VBUS)
VBUS:IN2: C46.2 FB2.2 SW4.5(COM-2)
NetC59_1: C59.1 J3.SHLD(SHELL)
NetJ3_A5: J3.A5(CC1) ; port USB_DBGR.CC1
NetJ3_B5: J3.B5(CC2) ; port USB_DBGR.CC2
NetP1_5: P1.5 ; port GPIO_P1.02
NetP1_6: P1.6 ; port GPIO_P1.03
NetR36_1: R36.1 SW4.3(N.C-1)

Not connected (* = marked no-connect by the designer): J3 A8(SBU1) B8(SBU2); J7 1 3 5; P0 8 9 10 11 12 13 14 15 16 17 18; P1 18; P2 14 15 16 17 18; P5 2; P15 7 8; P16 7 8 11 13; P19 7 8 9; P30 3; P31 3; P32 3; SW4 1(N.O-1) 6(N.C-2); U11 4(ID)*

### Layout directives
differential pair; differential pair class DBGR; net class DBGR_USB: DBGR'_N, DBGR'_P

### Notes on the sheet
- Debug IN Connector
- Place on top of Trace connector
- Main Power ON/OFF
- (near P16) Trace connector
- C16, C28, C51 change to 1uF
- Title
- Size
- Date:
- File:
- A3
- PCB Assembly Number
- Sheet
- Drawn By:
- Revision
- of
- Classification:
- (in symbol SD-80259-1021) B9; B4; B12; B1

### Library data of the parts
C16 C28 C51 = C0402-1µ0-6.3V-X5R-10%: Capacitor, X5R, ±10%, 6.3V; Manufacturer: N.A.; Part number Norautron: 26207137; Part number NEMS: 100200498; Pad Count: 2; Component Status: Active; Part Number: C0402-1µ0-6.3V-X5R-10%; Manufacturer Part Number: N.A.; LatestRevisionDate: 2022-01-27; Published: 2022-01-27; Value: 1.0µF; Note: 6.3V; Artikkelnr Noca: N.A.; Footprint Doc: 0402; Part number IPS: N.A.; ComponentLink1URL: N.A.; ComponentLink1Description: Datasheet; ComponentLink2URL: N.A.; ComponentLink2Description: Supplier link; HelpURL: N.A.; Supplier 1: N.A.; Supplier Part Number 1: N.A.; Supplier 2: N.A.; Supplier Part Number 2: N.A.; Component Class: Capacitors; PartId: 100200498; Author: rubr
C30 = C0201-10n: Capacitor, X7R, ±10%; Manufacturer: N.A.; Part number IPS: 00000003480; Part number Norautron: 26621779; Part number NEMS: 100200067; Note: 10V; Pad Count: 2; Component Status: Active; Part Number: C0201-10n; Manufacturer Part Number: N.A.; LatestRevisionDate: 2017-11-09; Published: 2014-11-13; Value: 10nF; Artikkelnr Noca: N.A.; Footprint Doc: 0201; ComponentLink1URL: N.A.; ComponentLink1Description: Datasheet; ComponentLink2URL: N.A.; ComponentLink2Description: Supplier link; HelpURL: N.A.; Supplier 1: N.A.; Supplier Part Number 1: N.A.; Supplier 2: N.A.; Supplier Part Number 2: N.A.; Component Class: Capacitors; PartId: 100200067; Author: rsk
C46 C48 C52 C55 C62 C63 C73 = C0201-100n: Capacitor, X5R, ±10%; Manufacturer: N.A.; Part number IPS: 00000001248, 00000002505; Part number Norautron: 262071862; Part number NEMS: 100200078; Note: 16V; Pad Count: 2; Component Status: Active; Part Number: C0201-100n; Manufacturer Part Number: N.A.; LatestRevisionDate: 2017-11-09; Published: 2014-11-13; Value: 100nF; Artikkelnr Noca: N.A.; Footprint Doc: 0201; ComponentLink1URL: N.A.; ComponentLink1Description: Datasheet; ComponentLink2URL: N.A.; ComponentLink2Description: Supplier link; HelpURL: N.A.; Supplier 1: N.A.; Supplier Part Number 1: N.A.; Supplier 2: N.A.; Supplier Part Number 2: N.A.; Component Class: Capacitors; PartId: 100200078; Author: rsk
C47 = C0402-1µ0-16V-X5R: Capacitor, Ceramic, X5R, ±10%, 16V; Manufacturer: Murata; Manufacturer Part Number: GRT155R61C105KE01D; Part number NEMS: 100200452; Component Status: Active; Pad Count: 2; Artikkelnr Noca: N.A.; Part Number: C0402-1µ0-16V-X5R; PartId: 100200452; Component Class: Capacitors; Author: rsk; ComponentLink1URL: https://search.murata.co.jp/Ceramy/image/img/A01X/G101/ENG/GRT155R61C105KE01-01.pdf; ComponentLink1Description: Datasheet; ComponentLink2URL: https://www.murata.com/en-global/products/productdetail?partno=GRT155R61C105KE01%23; ComponentLink2Description: Supplier link; HelpURL: N.A.; LatestRevisionDate: 2020-12-15; Published: 2020-12-15; Footprint Doc: 0402; Value: 1.0µF; Note: 16V; Supplier 1: Digi-Key; Supplier Part Number 1: 490-12255-1-ND; Supplier 2: Mouser; Supplier Part Number 2: 81-GRT155R61C105KE1D; Part number IPS: N.A.; Part number Norautron: N.A.
C54 = C0603-4µ7-10V-X7S: Capacitor, X7S, ±10%, 10V; Manufacturer: N.A.; Part number IPS: 00000001779; Part number NEMS: 100200351; Pad Count: 2; Artikkelnr Noca: 20030013; Component Status: Active; Part Number: C0603-4µ7-10V-X7S; Value: 4.7µF; Footprint Doc: 0603; Component Class: Capacitors; Author: rsk; PartId: 100200351; Manufacturer Part Number: N.A.; ComponentLink1URL: N.A.; ComponentLink1Description: Datasheet; ComponentLink2URL: N.A.; ComponentLink2Description: Supplier link; HelpURL: N.A.; LatestRevisionDate: 2016-08-15; Published: 2016-08-15; Note: 10V; Supplier 1: Digi-Key; Supplier Part Number 1: 445-14258-1-ND; Supplier 2: N.A.; Supplier Part Number 2: N.A.; Part number Norautron: N.A.
C59 = C0603-10n-100V-X7R: Capacitor, X7R, ±10%, 100V; Manufacturer: Murata; Manufacturer Part Number: GCM188R72A103KA37D; Part number NEMS: 100200349; Component Status: Active; Pad Count: 2; Artikkelnr Noca: N.A.; Part Number: C0603-10n-100V-X7R; PartId: 100200349; Component Class: Capacitors; Author: rsk; ComponentLink1URL: N.A.; ComponentLink1Description: Datasheet; ComponentLink2URL: N.A.; ComponentLink2Description: Supplier link; HelpURL: http://psearch.en.murata.com/capacitor/product/GCM188R72A103KA37%23.pdf; LatestRevisionDate: 2017-08-22; Published: 2017-08-22; Footprint Doc: 0603; Value: 10nF; Note: 100V; Supplier 1: Digi-Key; Supplier Part Number 1: 490-4781-1-ND; Supplier 2: N.A.; Supplier Part Number 2: N.A.; Part number IPS: N.A.; Part number Norautron: N.A.
FB2 = FB0402-120R@100M-500mA: Ferrite Bead, 120 Ohm @ 100MHz, 500mA, 250 mOhm Max; Manufacturer: Murata; Manufacturer Part Number: BLM15AG121SN1D; Part number IPS: 00000009954; Part number Norautron: 265230631; Part number NEMS: 100300099; Note: Chip EMIFIL Inductor Type Chip Ferrite Bead; Artikkelnr Noca: 33029317; Pad Count: 2; Component Status: Active; Part Number: FB0402-120R@100M-500mA; Footprint Doc: 0402; LatestRevisionDate: 2014-01-10; Published: 2011-11-14; Value: 120R/0.55A; ComponentLink1Description: Datasheet; ComponentLink2Description: Supplier link; ComponentLink1URL: N.A.; ComponentLink2URL: N.A.; HelpURL: http://search.murata.co.jp/Ceramy/image/img/PDF/ENG/L0110S0100BLM15A_SN.pdf; Supplier 1: Digi-Key; Supplier Part Number 1: 490-1005-1-ND; Supplier 2: Farnell; Supplier Part Number 2: 151-5760; Component Class: Inductors; PartId: 100300099; Author: rsk
J3 = SD-80259-1021: USB-C Receptacle, 16 Pin, USB 2.0; Manufacturer: Bellweather Electronic Corp.; Part number NEMS: 100500830; Component Status: Active; Pad Count: 16; Note: N.A.; System: Connector; Part Number: SD-80259-1021; PartId: 100500830; Component Class: Connectors; Author: getr; Manufacturer Part Number: SD-80259-1021; ComponentLink1URL: \\hizz\pro\app9717\Datasheet\connectors\Bellwether\SD-80259-001_C.pdf; ComponentLink1Description: Datasheet; ComponentLink2URL: N.A.; ComponentLink2Description: Supplier link; HelpURL: N.A.; LatestRevisionDate: 2023-10-30; Published: 2023-10-30; Footprint Doc: SD-80259-001; Value: USB-C 2.0; Supplier 1: Cabcon; Supplier Part Number 1: SD-80259-1021; Supplier 2: N.A.; Supplier Part Number 2: N.A.; Artikkelnr Noca: N.A.; Part number IPS: N.A.; Part number Norautron: N.A.
J7 = FPC_05P-0.5mm-RA-SMD: 0.5mm FPC, 5P,Right Angle SMT,Double Contact,H=1.2mm,White, Tin plated; Manufacturer: WCON; Manufacturer Part Number: 5141-05RZDNWR03; Part number NEMS: 100500528; Note: (Replaced 5141-05RZDNWR02); Artikkelnr Noca: N.A.; Pad Count: 7; Component Status: Active; System: Connector; Part Number: FPC_05P-0.5mm-RA-SMD; Footprint Doc: FPC_05P-0.5mm-RA-SMD; LatestRevisionDate: 2024-02-02; Published: 2015-06-22; Value: FPC 0.5mm RA SMD; Part number IPS: N.A.; ComponentLink1URL: N.A.; ComponentLink1Description: Datasheet; ComponentLink2URL: N.A.; ComponentLink2Description: Supplier link; HelpURL: \\hizz\pro\app9717\Datasheet\connectors\W-CON\5141-05RZDNXX02.pdf; Supplier 1: Cabcon; Supplier Part Number 1: 5141-05RZDNWR03; Supplier 2: N.A.; Supplier Part Number 2: N.A.; Component Class: Connectors; PartId: 100500528; Author: rsk; Part number Norautron: N.A.
P0-P2 = Pin Header 2x10 SMD, 2.54mm: Pin Header 2x10, 2.54mm (100mil) SMD; Manufacturer: WCON; Manufacturer Part Number: 1125-1210S0M116CR09; Part number NEMS: 100500738; Pad Count: 20; Artikkelnr Noca: N.A.; Component Status: Active; System: Connector; Part Number: Pin Header 2x10 SMD, 2.54mm; Component Class: Connectors; Author: stl1; ComponentLink1URL: https://suddendocs.samtec.com/catalog_english/tsm.pdf; ComponentLink1Description: Datasheet; ComponentLink2URL: https://www.digikey.no/en/products/detail/samtec-inc/TSM-110-02-S-DV/6679037; ComponentLink2Description: Supplier link; HelpURL: https://www.samtec.com/products/tsm-110-02-s-dv; Footprint Doc: HDR_2x10-SMD-2.54MM; LatestRevisionDate: 2024-02-21; Published: 2022-01-24; Note: SMD; Supplier 1: Cabcon; Supplier Part Number 1: 1125-1210S0M116CR09; Supplier 2: Samtec; Supplier Part Number 2: TSM-110-02-S-DV; Part number IPS: N.A.; Part number Norautron: N.A.; PartId: 100500738
  P0 P1: Value: Pin Hdr 2x10
  P2: VALUE: Pin Hdr 2x10
P5 = Pin List 1x3 SMD: Pin List 1x3, 2.54mm (100mil), SMD; Manufacturer: WCON; Manufacturer Part Number: 1125-1103S0M116CR04; Part number Norautron: 26470016; Part number NEMS: 100500306; Note: N.A.; Pad Count: 3; Component Status: Active; System: Connector; Part Number: Pin List 1x3 SMD; Footprint Doc: LIST_1x3_SMD; LatestRevisionDate: 2021-09-24; Published: 2013-10-21; Value: Pin List 1x3; Artikkelnr Noca: N.A.; ComponentLink1URL: N.A.; ComponentLink1Description: Datasheet; ComponentLink2URL: N.A.; ComponentLink2Description: Supplier link; HelpURL: N.A.; Part number IPS: N.A.; Supplier 1: Cabcon; Supplier Part Number 1: 1125-1103S0M116CR04; Supplier 2: Samtec; Supplier Part Number 2: TSM-103-01-L-SV-P-TR; Component Class: Connectors; PartId: 100500306; Author: rsk
P15 P19 = Pin Header 2x5 SMD, 1.27mm, KS: Pin Header 2x5, 1.27mm (50mil), SMD, Keying Shroud; Manufacturer: WCON; Manufacturer Part Number: 3132-10MS0BK00R5; Part number NEMS: 100500261; Note: (Replaced 3132-10MS0BK00R1); Artikkelnr Noca: N.A.; Pad Count: 10; Component Status: Active; System: Connector; Part Number: Pin Header 2x5 SMD, 1.27mm, KS; Footprint Doc: HDR_2x5-SMD-1.27mm; LatestRevisionDate: 2024-02-02; Published: 2016-01-22; Value: Pin Header 2x5, 1.27mm; Part number IPS: N.A.; ComponentLink1URL: N.A.; ComponentLink1Description: Datasheet; ComponentLink2URL: N.A.; ComponentLink2Description: Supplier link; HelpURL: \\hizz\pro\app9717\Datasheet\connectors\W-CON\3132-XXMXXBK00XX.pdf; Supplier 1: Cabcon; Supplier Part Number 1: 3132-10MS0BK00R5; Supplier 2: N.A.; Supplier Part Number 2: N.A.; Component Class: Connectors; PartId: 100500261; Author: rsk; Part number Norautron: N.A.
P16 = Pin Header 2x10 SMD, 1.27mm, KS, N.C.: Pin Header 2x10, 1.27mm (50mil), SMD, Keying Shroud; Manufacturer: WCON; Manufacturer Part Number: 3132-20MS0BK00R1; Part number NEMS: 100500279; Note: N.A.; Pad Count: 20; Component Status: Active; System: Connector; Part Number: Pin Header 2x10 SMD, 1.27mm, KS, N.C.; LatestRevisionDate: 2017-10-23; Published: 2017-09-07; VALUE: Pin Header 2x10, 1.27mm; Artikkelnr Noca: N.A.; Footprint Doc: HDR_2x10-SMD-1.27mm; Part number IPS: N.A.; ComponentLink1URL: N.A.; ComponentLink1Description: Datasheet; ComponentLink2URL: N.A.; ComponentLink2Description: Supplier link; HelpURL: N.A.; Supplier 1: Cabcon; Supplier Part Number 1: 3132-20MS0BK00R1; Supplier 2: Digi-Key; Supplier Part Number 2: FTSH-110-01-F-DV-K-ND; Component Class: Connectors; PartId: 100500279; Author: rsk; Part number Norautron: N.A.
P30-P32 = Pin Header 2x2 SMD: Pin Header 2x2, SMD, 2.54mm (100mil); Manufacturer: WCON; Manufacturer Part Number: 1125-1202S0M116CR03; Part number NEMS: 100500770; Component Status: Active; Pad Count: 4; Note: N.A.; System: Connector; Part Number: Pin Header 2x2 SMD; PartId: 100500770; Component Class: Connectors; Author: stl1; ComponentLink1URL: N.A.; ComponentLink1Description: Datasheet; ComponentLink2URL: N.A.; ComponentLink2Description: Supplier link; HelpURL: N.A.; LatestRevisionDate: 2024-02-21; Published: 2022-10-28; Footprint Doc: HDR_2x2-SMD; Value: Pin Header 2x2 SMD; Supplier 1: Cabcon; Supplier Part Number 1: 1125-1202S0M116CR03; Supplier 2: Samtec; Supplier Part Number 2: TSM-102-02-S-DV; Artikkelnr Noca: N.A.; Part number IPS: N.A.; Part number Norautron: N.A.
R36 = R0201-1k0: Resistor, ±1%, 0.05W; Manufacturer: N.A.; Part number IPS: 00000005786; Part number NEMS: 100100043; Component Status: Active; Pad Count: 2; Note: Chip Res 1%; Part Number: R0201-1k0; PartId: 100100043; Component Class: Resistors; Author: rsk; Manufacturer Part Number: N.A.; ComponentLink1URL: N.A.; ComponentLink1Description: Datasheet; ComponentLink2URL: N.A.; ComponentLink2Description: Supplier link; HelpURL: N.A.; LatestRevisionDate: 2014-11-13; Published: 2014-11-13; Footprint Doc: 0201; Value: 1k; Supplier 1: N.A.; Supplier Part Number 1: N.A.; Supplier 2: N.A.; Supplier Part Number 2: N.A.; Artikkelnr Noca: N.A.; Part number Norautron: N.A.
SW4 = Switch-Slide-RA-J-Lead-DPDT-8.5x3.5mm_C&K: SMD slide Switch (ON-ON); Manufacturer: C&K; Part number IPS: 00000007811; Part number NEMS: 101500037; Component Status: Active; Pad Count: 6; Note: N.A.; Part Number: Switch-Slide-RA-J-Lead-DPDT-8.5x3.5mm_C&K; PartId: 101500037; Component Class: Switches; Author: rsk; ComponentLink1URL: N.A.; ComponentLink1Description: Datasheet; ComponentLink2URL: N.A.; ComponentLink2Description: Supplier link; HelpURL: http://www.ck-components.com/media/1422/js.pdf; LatestRevisionDate: 2017-02-01; Published: 2016-09-15; Footprint Doc: Switch-Slide-RA-J-Lead-DPDT-8.5x3.5mm; Value: Switch; Supplier 1: Digi-Key; Supplier Part Number 1: CKN10722CT-ND; Supplier 2: Mouser; Supplier Part Number 2: 611-JS202011JAQN; Artikkelnr Noca: N.A.; Part number Norautron: N.A.
TP16-TP18 = TP_SMD_Ø1.5MM: 1.5mm circular SMD testpad; Manufacturer: Nordic Semiconductor; Manufacturer Part Number: N.A.; Part number NEMS: 100500477; Pad Count: 1; Component Status: Active; Part Number: TP_SMD_Ø1.5MM; LatestRevisionDate: 2021-03-05; Published: 2016-06-02; Value: Ø1.5mm,SMD; Note: N.A.; Artikkelnr Noca: N.A.; Footprint Doc: TP_SMD_Ø1.5mm; Part number IPS: N.A.; ComponentLink1URL: N.A.; ComponentLink1Description: Datasheet; ComponentLink2URL: N.A.; ComponentLink2Description: Supplier link; HelpURL: N.A.; Supplier 1: N.A.; Supplier Part Number 1: N.A.; Supplier 2: N.A.; Supplier Part Number 2: N.A.; Component Class: Connectors; PartId: 100500477; Author: rsk; Part number Norautron: N.A.
TP22 = TP - S1751-46R: PC TEST POINT TIN SMD L; Manufacturer: Harwin; Part number NEMS: 100500525; Component Status: Active; Pad Count: 1; Note: N.A.; Part Number: TP - S1751-46R; PartId: 100500525; Component Class: Connectors; Author: rsk; Manufacturer Part Number: S1751-46R; ComponentLink1URL: N.A.; ComponentLink1Description: Datasheet; ComponentLink2URL: N.A.; ComponentLink2Description: Supplier link; HelpURL: http://cdn.harwin.com/pdfs/S1751.pdf; LatestRevisionDate: 2015-05-29; Published: 2015-05-29; Footprint Doc: Harwin S1751-46R; Value: TP; Supplier 1: Digi-Key; Supplier Part Number 1: 952-1478-1-ND; Supplier 2: N.A.; Supplier Part Number 2: N.A.; Artikkelnr Noca: N.A.; Part number IPS: N.A.; Part number Norautron: N.A.
U11 = ECMF02-4CMX8: 2 Line Common mode filter with ESD protection for USB 2.0 interface; Manufacturer: STMicroelectronics; Part number NEMS: 100800034; Component Status: Active; Pad Count: 8; Note: N.A.; Part Number: ECMF02-4CMX8; PartId: 100800034; Component Class: Filters; Author: eisk; Manufacturer Part Number: ECMF02-4CMX8; ComponentLink1URL: https://www.st.com/content/ccc/resource/technical/document/datasheet/group3/1c/93/cf/72/85/cf/4d/d6/DM00039389/files/DM00039389.pdf/jcr:content/translations/en.DM00039389.pdf; ComponentLink1Description: Datasheet; ComponentLink2URL: https://www.digikey.com/en/products/detail/stmicroelectronics/ECMF02-4CMX8/3770020; ComponentLink2Description: Supplier link; HelpURL: https://www.st.com/content/ccc/resource/technical/document/datasheet/group3/1c/93/cf/72/85/cf/4d/d6/DM00039389/files/DM00039389.pdf/jcr:content/translations/en.DM00039389.pdf; LatestRevisionDate: 2024-01-31; Published: 2024-01-31; Footprint Doc: UFDFN-8; Value: ECMF02-4CMX8; Supplier 1: Digi-Key; Supplier Part Number 1: 497-13420-2-ND; Supplier 2: Mouser; Supplier Part Number 2: 511-ECMF02-4CMX8; Artikkelnr Noca: N.A.; Part number IPS: N.A.; Part number Norautron: N.A.

## Sheet pca10156_sheet8_switches.SchDoc: =BoardTitle+' - QSPI Switching'
size A3; Organization: Nordic Semiconductor; DocumentNumber: 8; Revision: 1.0.0; SheetNumber: 8; SheetTotal: 8; Author: STL1; CompanyName: Nordic Semiconductor; DrawnBy: STL1; DocumentSize: A4
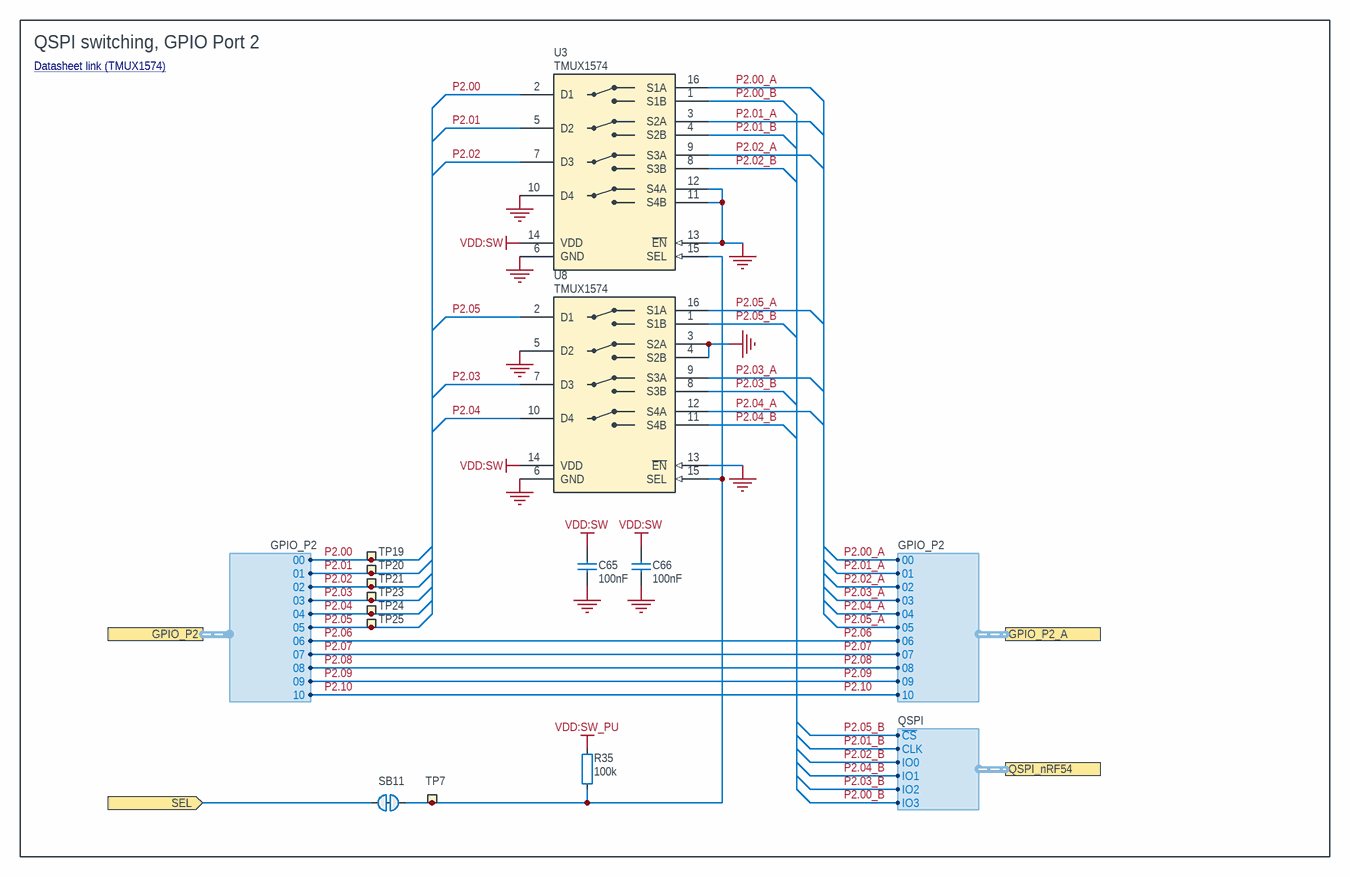
[diagram p7: pca10156_sheet8_switches.SchDoc]

### Parts
C65  100nF  [CAPC0603X03L_C]
C66  100nF  [CAPC0603X03L_C]
R35  100k  [RESC0603X03L_C]
SB11  Solderbridge  [Solderbridge_Shorted]  (value not drawn)  (net tie, no BOM)
TP7  Ø0.7mm,SMD  [TP_SMD_D0.7mm]  (value not drawn)  (no BOM)
TP19  Ø0.7mm,SMD  [TP_SMD_D0.7mm]  (value not drawn)  (no BOM)
TP20  Ø0.7mm,SMD  [TP_SMD_D0.7mm]  (value not drawn)  (no BOM)
TP21  Ø0.7mm,SMD  [TP_SMD_D0.7mm]  (value not drawn)  (no BOM)
TP23  Ø0.7mm,SMD  [TP_SMD_D0.7mm]  (value not drawn)  (no BOM)
TP24  Ø0.7mm,SMD  [TP_SMD_D0.7mm]  (value not drawn)  (no BOM)
TP25  Ø0.7mm,SMD  [TP_SMD_D0.7mm]  (value not drawn)  (no BOM)
U3  TMUX1574  [XQFN40P180X260X50-16N]
U8  TMUX1574  [XQFN40P180X260X50-16N]

### Ports
GPIO_P2 (harness GPIO_P2), GPIO_P2_A (harness GPIO_P2), QSPI_nRF54 (harness QSPI), SEL (in)

### Harnesses
GPIO_P2: 00, 01, 02, 03, 04, 05, 06, 07, 08, 09, 10
QSPI: ~{CS}, IO0, CLK, IO1, IO2, IO3

### Nets
GND: C65.2 C66.2 U3.6(GND) U3.10(D4) U3.11(S4B) U3.12(S4A) U3.13(~{EN}) U8.3(S2A) U8.4(S2B) U8.5(D2) U8.6(GND) U8.13(~{EN})
VDD:SW: C65.1 C66.1 U3.14(VDD) U8.14(VDD)
VDD:SW_PU: R35.2
P2.00: TP19.1 U3.2(D1) ; port GPIO_P2.00
P2.00_A: U3.16(S1A) ; port GPIO_P2_A.00
P2.00_B: U3.1(S1B) ; port QSPI_nRF54.IO3
P2.01: TP20.1 U3.5(D2) ; port GPIO_P2.01
P2.01_A: U3.3(S2A) ; port GPIO_P2_A.01
P2.01_B: U3.4(S2B) ; port QSPI_nRF54.CLK
P2.02: TP21.1 U3.7(D3) ; port GPIO_P2.02
P2.02_A: U3.9(S3A) ; port GPIO_P2_A.02
P2.02_B: U3.8(S3B) ; port QSPI_nRF54.IO0
P2.03: TP23.1 U8.7(D3) ; port GPIO_P2.03
P2.03_A: U8.9(S3A) ; port GPIO_P2_A.03
P2.03_B: U8.8(S3B) ; port QSPI_nRF54.IO2
P2.04: TP24.1 U8.10(D4) ; port GPIO_P2.04
P2.04_A: U8.12(S4A) ; port GPIO_P2_A.04
P2.04_B: U8.11(S4B) ; port QSPI_nRF54.IO1
P2.05: TP25.1 U8.2(D1) ; port GPIO_P2.05
P2.05_A: U8.16(S1A) ; port GPIO_P2_A.05
P2.05_B: U8.1(S1B) ; port QSPI_nRF54.~{CS}
P2.06: port GPIO_P2.06, port GPIO_P2_A.06
P2.07: port GPIO_P2.07, port GPIO_P2_A.07
P2.08: port GPIO_P2.08, port GPIO_P2_A.08
P2.09: port GPIO_P2.09, port GPIO_P2_A.09
P2.10: port GPIO_P2.10, port GPIO_P2_A.10
QSPI_CTRL: SB11.1 ; port SEL
NetR35_1: R35.1 SB11.2 TP7.1 U3.15(SEL) U8.15(SEL)

### Notes on the sheet
- QSPI switching, GPIO Port 2
- Datasheet link (TMUX1574) <https://www.ti.com/lit/ds/symlink/tmux1574.pdf?ts=1730869182960>
- Title
- Size
- Date:
- File:
- A3
- PCB Assembly Number
- Sheet
- Drawn By:
- Revision
- of
- Classification:

### Library data of the parts
C65 C66 = C0201-100n: Capacitor, X5R, ±10%; Manufacturer: N.A.; Part number IPS: 00000001248, 00000002505; Part number Norautron: 262071862; Part number NEMS: 100200078; Pad Count: 2; Note: 16V; Component Status: Active; Part Number: C0201-100n; LatestRevisionDate: 2017-11-09; Published: 2014-11-13; Value: 100nF; Footprint Doc: 0201; Component Class: Capacitors; PartId: 100200078; Author: rsk; Manufacturer Part Number: N.A.; ComponentLink1URL: N.A.; ComponentLink1Description: Datasheet; ComponentLink2URL: N.A.; ComponentLink2Description: Supplier link; HelpURL: N.A.; Supplier 1: N.A.; Supplier Part Number 1: N.A.; Supplier 2: N.A.; Supplier Part Number 2: N.A.; Artikkelnr Noca: N.A.
R35 = R0201-100k: Resistor, ±1%, 0.05W; Manufacturer: N.A.; Part number IPS: 00000001419; Part number Norautron: 26108487; Part number NEMS: 100100080; Note: Chip Res 1%; Pad Count: 2; Component Status: Active; Part Number: R0201-100k; Manufacturer Part Number: N.A.; ComponentLink1URL: N.A.; ComponentLink1Description: Datasheet; ComponentLink2URL: N.A.; ComponentLink2Description: Supplier link; HelpURL: N.A.; Footprint Doc: 0201; LatestRevisionDate: 2014-11-13; Published: 2014-11-13; Value: 100k; Artikkelnr Noca: N.A.; Supplier 1: N.A.; Supplier Part Number 1: N.A.; Supplier 2: N.A.; Supplier Part Number 2: N.A.; Component Class: Resistors; PartId: 100100080; Author: rsk
SB11 = Solderbridge Shorted: Shorted Solderbridge; Manufacturer: N.A.; Part number NEMS: 100500459; Pad Count: 2; Component Status: Active; System: Connector; Part Number: Solderbridge Shorted; Manufacturer Part Number: N.A.; LatestRevisionDate: 2012-08-07; Published: 2012-08-07; Value: Solderbridge; Note: N.A.; Artikkelnr Noca: N.A.; Footprint Doc: Solderbridge_Shorted; Part number IPS: N.A.; ComponentLink1URL: N.A.; ComponentLink1Description: Datasheet; ComponentLink2URL: N.A.; ComponentLink2Description: Supplier link; HelpURL: N.A.; Supplier 1: N.A.; Supplier Part Number 1: N.A.; Supplier 2: N.A.; Supplier Part Number 2: N.A.; Component Class: Connectors; PartId: 100500459; Author: rsk; Part number Norautron: N.A.
TP7 TP19-TP21 TP23-TP25 = TP_SMD_Ø0.7MM: 0.7mm circular SMD testpad; Manufacturer: Nordic Semiconductor; Manufacturer Part Number: N.A.; Part number NEMS: 100500474; Component Status: Active; Pad Count: 1; Part Number: TP_SMD_Ø0.7MM; PartId: 100500474; Component Class: Connectors; Author: rsk; ComponentLink1URL: N.A.; ComponentLink1Description: Datasheet; ComponentLink2URL: N.A.; ComponentLink2Description: Supplier link; HelpURL: N.A.; LatestRevisionDate: 2021-03-05; Published: 2017-12-14; Footprint Doc: TP_SMD_Ø0.7mm; Value: Ø0.7mm,SMD; Note: N.A.; Supplier 1: N.A.; Supplier Part Number 1: N.A.; Supplier 2: N.A.; Supplier Part Number 2: N.A.; Artikkelnr Noca: N.A.; Part number IPS: N.A.; Part number Norautron: N.A.
U3 U8 = TMUX1574: Low-Capacitance, 2:1 (SPDT) 4-Channel, analog switch; Manufacturer: Texas Instruments; Manufacturer Part Number: TMUX1574RSVR; Part number NEMS: 101900850; Component Status: Active; Pad Count: 16; Note: N.A.; Part Number: TMUX1574; Component Class: Misc_ICs; Author: stl1; ComponentLink1URL: https://www.ti.com/lit/ds/symlink/tmux1574.pdf?ts=1730869182960; ComponentLink1Description: Datasheet; ComponentLink2URL: N.A.; ComponentLink2Description: Supplier link; HelpURL: https://www.ti.com/lit/ds/symlink/tmux1574.pdf?ts=1730869182960; LatestRevisionDate: 2024-11-20; Published: 2024-11-20; Footprint Doc: UFQFN-16; Value: TMUX1574; Supplier 1: Digi-Key; Supplier Part Number 1: 296-53445-2-ND; Supplier 2: Mouser; Supplier Part Number 2: 595-TMUX1574RSVR; Artikkelnr Noca: N.A.; Part number IPS: N.A.; Part number Norautron: N.A.; PartId: 101900850